# Altium schematic sheet Sheet2.SchDoc
size A
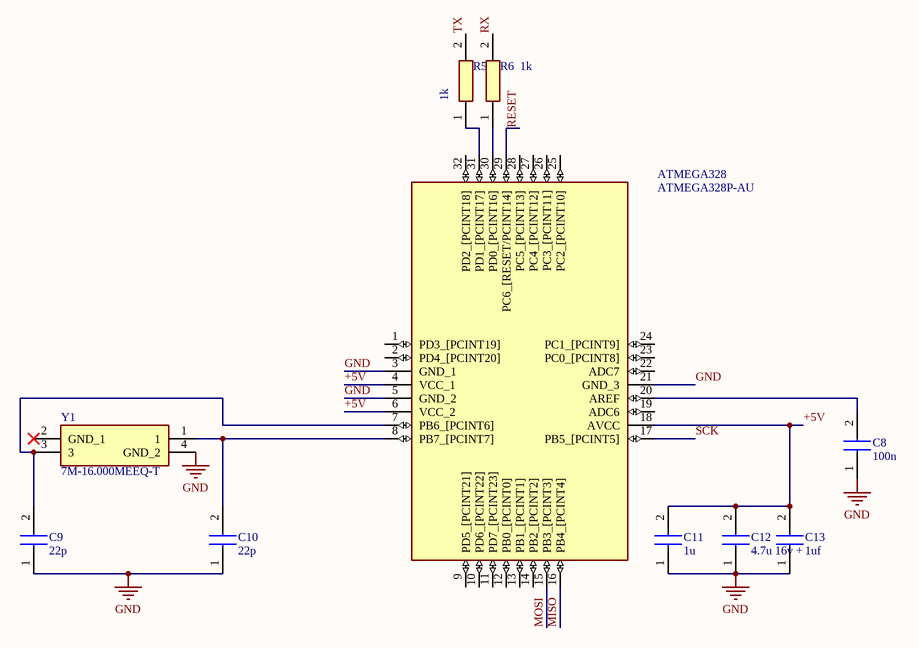
[diagram p0: Sheet2.SchDoc]

## Parts
ATMEGA328  ATMEGA328P-AU  [QFP80P900X900X120-32N]
C8  100n  [CAPC1608X87N]
C9  22p  [CAPC1608X87N]
C10  22p  [CAPC1608X87N]
C11  1u  [CAPC1608X87N]
C12  4.7u 16v +  [CAPC1608X87N]
C13  1uf  [CAPC1608X87N]
R5  1k  [RESC2012X65N]
R6  1k  [RESC2012X65N]
Y1  7M-16.000MEEQ-T  [7M]

## Nets
GND: ATMEGA328.3(GND_1) ATMEGA328.5(GND_2) ATMEGA328.21(GND_3) C8.1 C9.1 C10.1 C11.1 C12.1 C13.1 Y1.4(GND_2)
+5V: ATMEGA328.4(VCC_1) ATMEGA328.6(VCC_2) ATMEGA328.18(AVCC) C11.2 C12.2 C13.2
MISO: ATMEGA328.16(PB4_[PCINT4])
MOSI: ATMEGA328.15(PB3_[PCINT3])
RESET: ATMEGA328.29(PC6_[RESET/PCINT14])
RX: R6.2
SCK: ATMEGA328.17(PB5_[PCINT5])
TX: R5.2
NetATMEGA328_7: ATMEGA328.7(PB6_[PCINT6]) C9.2 Y1.3
NetATMEGA328_8: ATMEGA328.8(PB7_[PCINT7]) C10.2 Y1.1
NetATMEGA328_20: ATMEGA328.20(AREF) C8.2
NetATMEGA328_30: ATMEGA328.30(PD0_[PCINT16]) R6.1
NetATMEGA328_31: ATMEGA328.31(PD1_[PCINT17]) R5.1

Not connected (* = marked no-connect by the designer): ATMEGA328 1(PD3_[PCINT19]) 2(PD4_[PCINT20]) 9(PD5_[PCINT21]) 10(PD6_[PCINT22]) 11(PD7_[PCINT23]) 12(PB0_[PCINT0]) 13(PB1_[PCINT1]) 14(PB2_[PCINT2]) 19(ADC6) 22(ADC7) 23(PC0_[PCINT8]) 24(PC1_[PCINT9]) 25(PC2_[PCINT10]) 26(PC3_[PCINT11]) 27(PC4_[PCINT12]) 28(PC5_[PCINT13]) 32(PD2_[PCINT18]); Y1 2(GND_1)*

## Library data of the parts
ATMEGA328 = ATMEGA328P-AU: Integrated Circuit; Manufacturer_Name: Microchip; Datasheet Link: https://componentsearchengine.com/Datasheets/2/ATMEGA328P-AU.pdf; Height: 1.2mm; Manufacturer_Part_Number: ATMEGA328P-AU; Mouser Part Number: 556-ATMEGA328P-AU; Mouser Price/Stock: https://www.mouser.co.uk/ProductDetail/Microchip-Technology-Atmel/ATMEGA328P-AU/?qs=K8BHR703ZXiCmmgp6%2FGNmQ%3D%3D; Arrow Part Number: ATMEGA328P-AU; Arrow Price/Stock: https://www.arrow.com/en/products/atmega328p-au/microchip-technology
C8-C13 = C0603C569J5GACTU: Capacitor; Manufacturer_Name: Kemet; Datasheet Link: https://content.kemet.com/datasheets/KEM_C1003_C0G_SMD.pdf; Height: 0.87mm; Manufacturer_Part_Number: C0603C569J5GACTU; Arrow Part Number: C0603C569J5GACTU; Arrow Price/Stock: https://www.arrow.com/en/products/c0603c569j5gactu/kemet-corporation
R5 R6 = CPF0805B340RE1: Resistor; Manufacturer_Name: TE Connectivity; Datasheet Link: http://docs-europe.electrocomponents.com/webdocs/13d1/0900766b813d116f.pdf; Height: 0.65mm; Manufacturer_Part_Number: CPF0805B340RE1
Y1 = 7M-16.000MEEQ-T: Crystal or Oscillator; Manufacturer_Name: TXC; Description: Crystals 16.000MHz 10ppm -20 +70C 10pF; Datasheet Link: http://www.mouser.com/ds/2/417/7m-11184.pdf; Manufacturer_Part_Number: 7M-16.000MEEQ-T; Mouser Part Number: 717-7M-16.000MEEQ-T; Mouser Price/Stock: https://www.mouser.co.uk/ProductDetail/TXC-Corporation/7M-16000MEEQ-T?qs=65dIHZNch5syu%2FvH9aFnbA%3D%3D; Arrow Part Number: 7M-16.000MEEQ-T; Arrow Price/Stock: https://www.arrow.com/en/products/7m-16.000meeq-t/txc-corporation